# EAGLE design plaquinha (EAGLE 9.6.2)
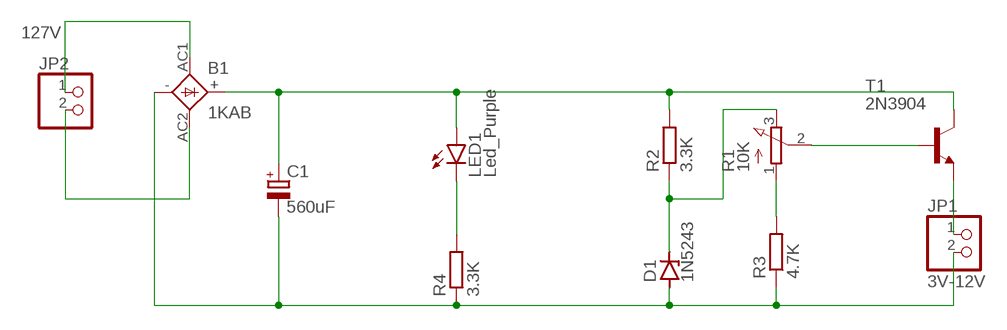
[diagram p0: schematic, sheet 1]

## Parts
B1  1KAB  [1KAB]
C1  560uF  CPOL-EUE5-10.5  [E5-10,5]
D1  1N5243  1N4728  [DO41Z10]
JP1  3V-12V  PINHD-1X2  [1X02]
JP2  127V  PINHD-1X2  [1X02]
LED1  Led_Purple  LED5MM  [LED5MM]
R1  10K  3RP/1610N  [3RP/1610N]
R2  3.3K  R-EU_0204/7  [0204/7]
R3  4.7K  R-EU_0204/7  [0204/7]
R4  3.3K  R-EU_0204/7  [0204/7]
T1  2N3904  [TO92]

## Nets
N$1: D1.C R1.3(E) R2.1
N$2: JP1.1 T1.3(E)
N$3: LED1.K(C) R4.2
N$4: B1.+ C1.+ LED1.A R2.2 T1.1(C)
N$5: B1.AC1 JP2.1
N$7: R1.1(A) R3.2
N$8: B1.AC2 JP2.2
N$9: R1.2(S) T1.2(B)
N$10: B1.- C1.- D1.A JP1.2 R3.1 R4.1

## Library data of the parts
B1 = rectifier:1KAB: RECTIFIER grid 5,08 x 5,08 mm
C1 = rcl:CPOL-EU: POLARIZED CAPACITOR, European symbol; SPICEPREFIX: C
D1 = diode:1N4728: Z DIODE 3.3 V, 1W, 5 percent
JP1 JP2 = pinhead:PINHD-1X2: PIN HEADER
LED1 = led:LED: LED OSRAM: - CHIPLED LG R971, LG N971, LY N971, LG Q971, LY Q971, LO R971, LY R971 LH N974, LH R974 LS Q976, LO Q976, LY Q976 LO Q996 - Hyper CHIPLED LW Q18S LB Q993, LB Q99A, LB R99A - SideLED LS A670, LO A670, LY A670, LG A670, LP A670 LB A673, LV A673, LT A673, LW A673 LH A674 LY A675 LS A676, LA A676, LO A676, LY A676, LW A676 LS A679, LY A679, LG A679 - Hyper Micro SIDELED® LS Y876, LA Y876, LO Y876, LY Y876 LT Y87S - SmartLED LW L88C, LW L88S LB L89C, LB L89S, LG L890 LS L89K, LO L89K, LY L89K LS L896, LA L896, LO L896, LY L896 - TOPLED LS T670, LO T670, LY T670, LG T670, LP T670 LSG T670, LSP T670, LSY T670, LOP T670, LYG T670 LG T671, LOG T671, LSG T671 LB T673, LV T673, LT T673, LW T673 LH T674 LS T676, LA T676, LO T676, LY T676, LB T676, LH T676, LSB T676, LW T676 LB T67C, LV T67C, LT T67C, LS T67K, LO T67K, LY T67K, LW E67C LS E67B, LA E67B, LO E67B, LY E67B, LB E67C, LV E67C, LT E67C LW T67C LS T679, LY T679, LG T679 LS T770, LO T770, LY T770, LG T770, LP T770 LB T773, LV T773, LT T773, LW T773 LH T774 LS E675, LA E675, LY E675, LS T675 LS T776, LA T776, LO T776, LY T776, LB T776 LHGB T686 LT T68C, LB T68C - Hyper Mini TOPLED® LB M676 - Mini TOPLED Santana® LG M470 LS M47K, LO M47K, LY M47K Source: http://www.osram.convergy.de LUXEON: - LUMILED® LXK2-PW12-R00, LXK2-PW12-S00, LXK2-PW14-U00, LXK2-PW14-V00 LXK2-PM12-R00, LXK2-PM12-S00, LXK2-PM14-U00 LXK2-PE12-Q00, LXK2-PE12-R00, LXK2-PE12-S00, LXK2-PE14-T00, LXK2-PE14-U00 LXK2-PB12-K00, LXK2-PB12-L00, LXK2-PB12-M00, LXK2-PB14-N00, LXK2-PB14-P00, LXK2-PB14-Q00 LXK2-PR12-L00, LXK2-PR12-M00, LXK2-PR14-Q00, LXK2-PR14-R00 LXK2-PD12-Q00, LXK2-PD12-R00, LXK2-PD12-S00 LXK2-PH12-R00, LXK2-PH12-S00 LXK2-PL12-P00, LXK2-PL12-Q00, LXK2-PL12-R00 Source: www.luxeon.com KINGBRIGHT: KA-3528ASYC Source: www.kingbright.com
R1 = pot:3RP/1610N: 16mm Potentiometer one level Source: http://www.alphapotentiometers.net/html/16mm_pot_2.html
R2-R4 = rcl:R-EU_: RESISTOR, European symbol; SPICEPREFIX: R
T1 = transistor:2N3904: NPN TRANSISTOR

## Board
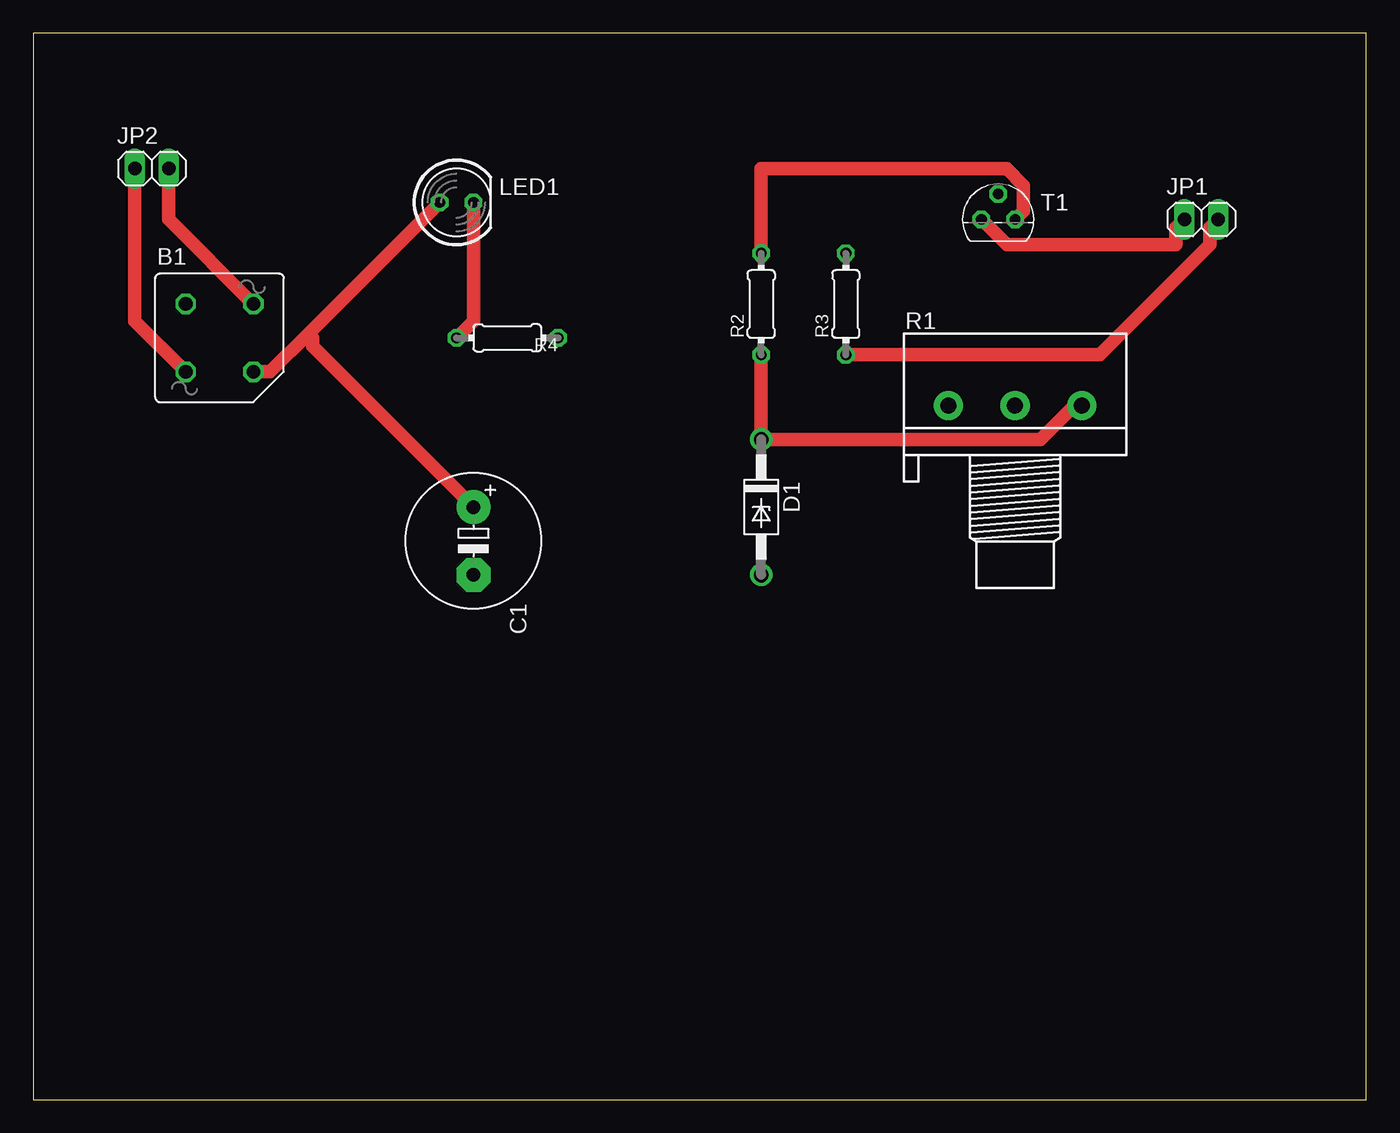
[diagram p1: board, top side]
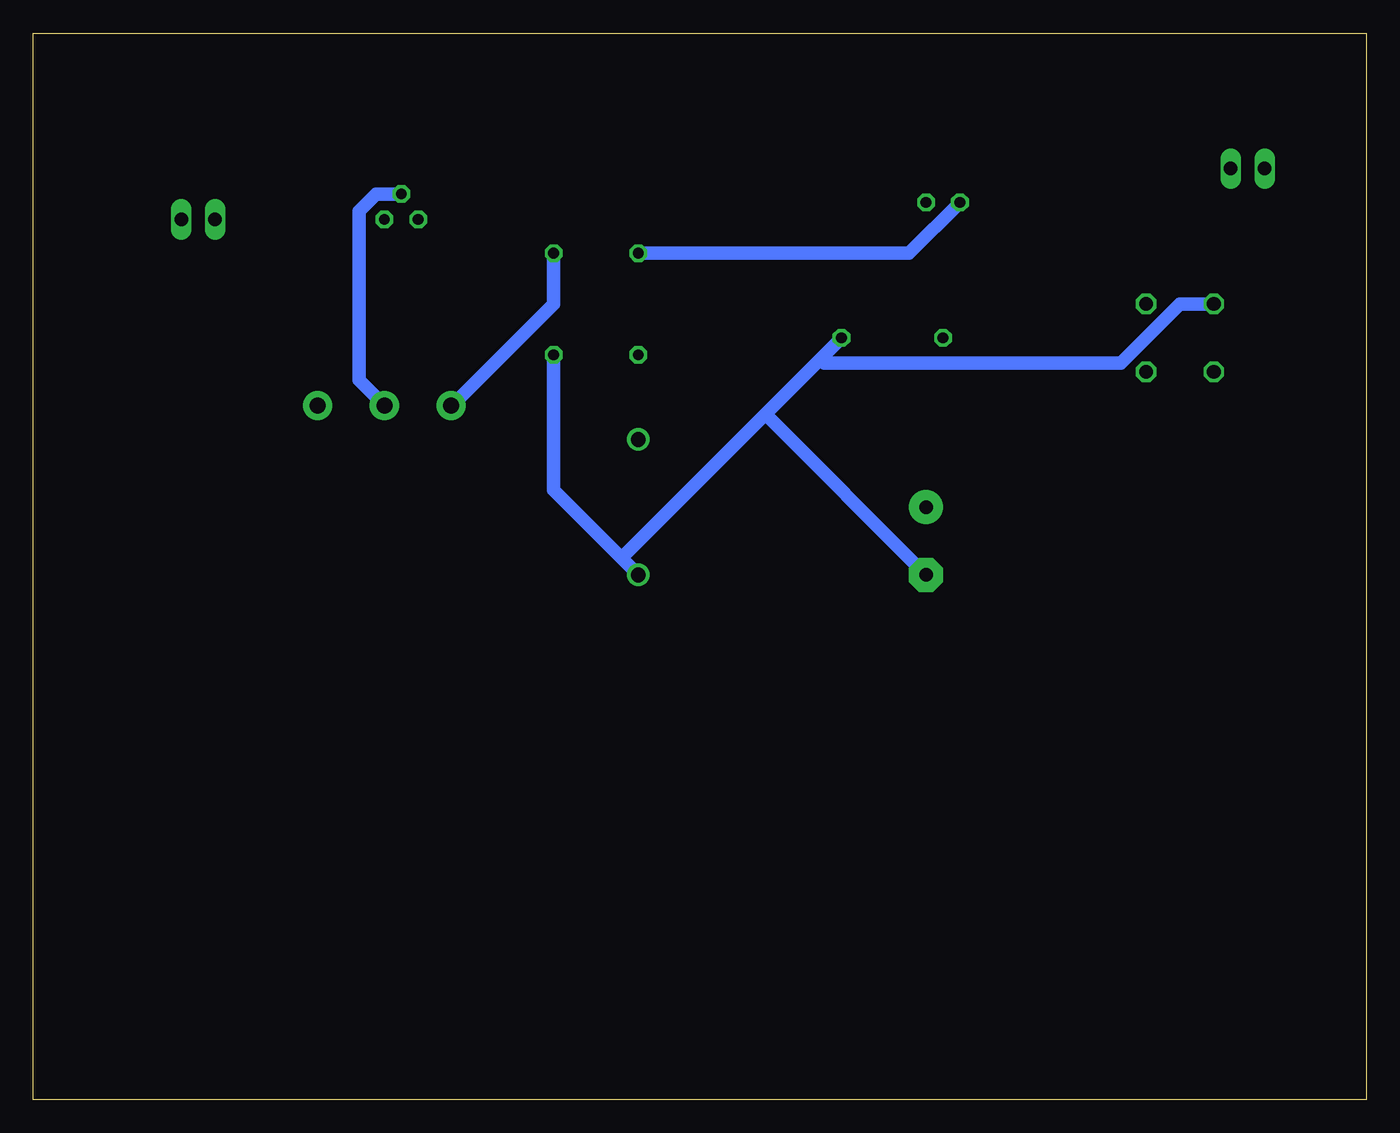
[diagram p2: board, bottom side, seen from below]

Size 100 x 80 mm. Coordinates in mm from the lower left corner, seen from the top.
Outline: 0,0 100,0 100,80 0,80 0,0
Copper layers (1*16): Top 0.035mm / dielectric 1.5mm / Bottom 0.035mm
Design rules "default *": minimum track width 40mil, minimum drill 0.35mm, track to track 20mil, track to pad 20mil, pad to pad 20mil, via to via 20mil, smd to smd 6mil, copper to edge 20mil, drill to drill 6mil, minimum pad ring 10mil, minimum via ring 8mil, stop-mask expansion 4mil, vias tented up to drill 0mil, thermal gap 10mil

### Footprints (pad centres in the part's own frame; a part is rotated, then mirrored left to right if it is on the bottom)
1KAB = drill 1.016 octagon: + 2.54,-2.54; - -2.54,2.54; AC1 -2.54,-2.54; AC2 2.54,2.54
E5-10,5 = drill 1.016 pad 2.54: + -2.54,0 | drill 1.016 pad 2.54 octagon: - 2.54,0
DO41Z10 = drill 1.118: A 5.08,0; C -5.08,0
1X02 = drill 1.016 long: 1 -1.27,0; 2 1.27,0
LED5MM = drill 0.813 octagon: A -1.27,0; K 1.27,0
3RP/1610N = drill 1.2 pad 2.184: 1 -5,0; 2 0,0; 3 5,0
0204/7 = drill 0.813 octagon: 1 -3.81,0; 2 3.81,0
TO92 = drill 0.813 octagon: 1 1.27,0; 2 0,1.905; 3 -1.27,0

### Placement (x,y rotation side)
B1  13.97,57.15 0 top
C1  33.02,41.91 270 top
D1  54.61,44.45 270 top
JP1  87.63,66.04 0 top
JP2  8.89,69.85 0 top
LED1  31.75,67.31 0 top
R1  73.66,52.07 0 top
R2  54.61,59.69 90 top
R3  60.96,59.69 90 top
R4  35.56,57.15 180 top
T1  72.39,66.04 0 top

### Tracks (layer width: path | path; a pad name or v marks a point on that pad's centre or on a via)
N$1
  Top 1.016: R2.1 D1.C 75.56,49.53 78.11,52.07 R1.3
N$2
  Top 1.016: T1.3 73.03,64.14 85.72,64.14 85.72,65.41 JP1.1
N$3
  Top 1.016: R4.2 33.02,58.42 LED1.K
N$4
  Top 1.016: 20.64,57.47 17.78,54.61 B1.+ | 20.64,57.47 LED1.A | T1.1 74.3,66.67 74.3,68.58 73.03,69.85 54.61,69.85 R2.2 | C1.+ 20.95,56.52 20.95,57.15 20.64,57.47
  Bottom 1.016: R2.2 34.29,63.5 LED1.A
N$5
  Top 1.016: B1.AC1 7.62,58.42 JP2.1
N$7
  Bottom 1.016: R3.2 60.96,59.69 68.58,52.07 R1.1
N$8
  Top 1.016: B1.AC2 10.16,66.04 JP2.2
N$9
  Bottom 1.016: T1.2 74.3,67.94 75.56,66.67 75.56,53.98 R1.2
N$10
  Top 1.016: JP1.2 88.27,65.41 88.27,64.14 80.01,55.88 R3.1
  Bottom 1.016: R3.1 60.96,45.72 55.88,40.64 | D1.A 55.88,40.64 | 55.88,40.64 45.09,51.44 | 45.09,51.44 40.96,55.56 | 40.96,55.56 R4.1 | B1.- 13.97,59.69 18.41,55.24 40.64,55.24 40.96,55.56 | 45.09,51.44 C1.-